# Altium schematic sheet PLACALDR.SchDoc
size A4
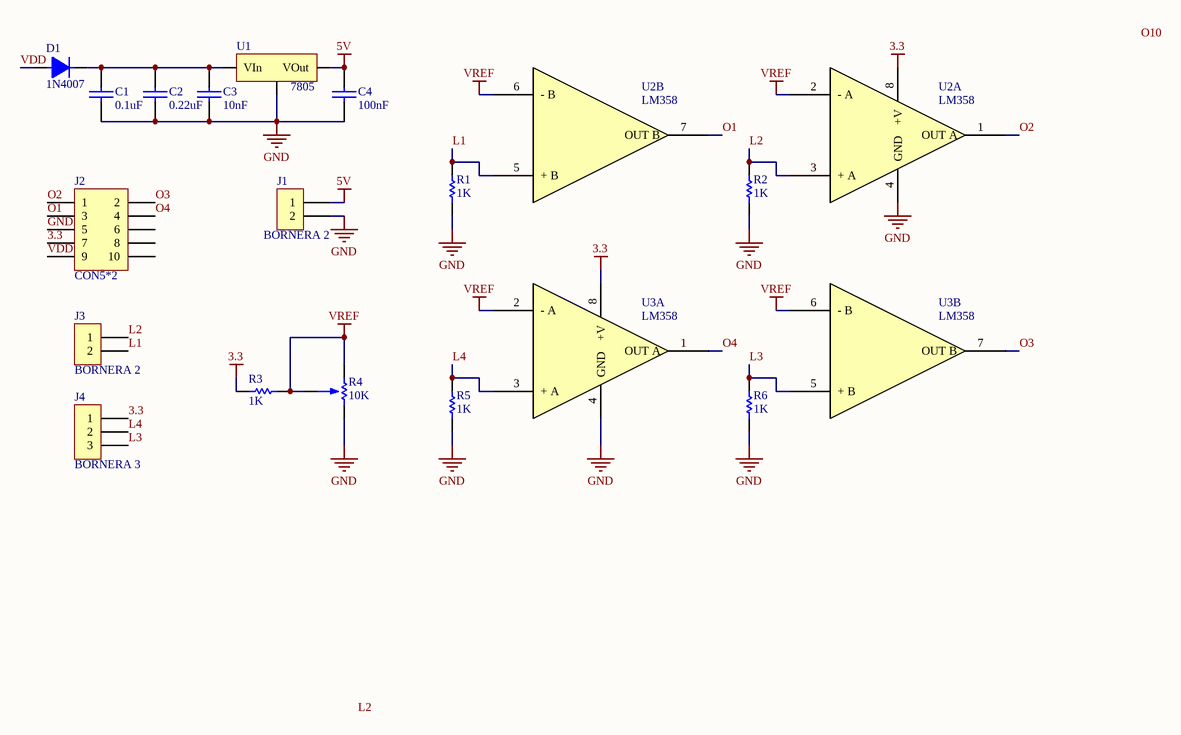
[diagram p0: PLACALDR.SchDoc]

## Parts
C1  0.1uF  [CAP100]
C2  0.22uF  [CAP100]
C3  10nF  [CAP100]
C4  100nF  [CAP100]
D1  1N4007  [DO41]
J1  BORNERA 2  [BORNERA2]
J2  CON5*2  [SIP5*2]
J3  BORNERA 2  [BORNERA2]
J4  BORNERA 3  [BORNERA3]
R1  1K  [RES400]
R2  1K  [RES400]
R3  1K  [RES400]
R4  10K  [PRESET H]
R5  1K  [RES400]
R6  1K  [RES400]
U1  7805  [TO-220 V]
U2  LM358  [DIP8]  (parts A,B of 2)
U3  LM358  [DIP8]  (parts A,B of 2)

## Nets
3.3: J2.7 J4.1 R3.2 U2.8(+V) U3.8(+V)
5V: C4.1 J1.1 U1.3(VOut)
GND: C1.2 C2.2 C3.2 C4.2 J1.2 J2.5 R1.2 R2.2 R4.1 R5.2 R6.2 U1.2(GND) U2.4(GND) U3.4(GND)
VREF: R3.1 R4.2 R4.3 U2.2(-_A) U2.6(-_B) U3.2(-_A) U3.6(-_B)
L1: J3.2 R1.1 U2.5(+_B)
L2: J3.1 R2.1 U2.3(+_A)
L3: J4.3 R6.1 U3.5(+_B)
L4: J4.2 R5.1 U3.3(+_A)
O1: J2.3 U2.7(OUT_B)
O2: J2.1 U2.1(OUT_A)
O3: J2.2 U3.7(OUT_B)
O4: J2.4 U3.1(OUT_A)
VDD: D1.1 J2.9
NetC1_1: C1.1 C2.1 C3.1 D1.2 U1.1(VIn)

Not connected (* = marked no-connect by the designer): J2 6 8 10

## Notes on the sheet
- Labels drawn without touching a wire or pin: L2, O10
- Title
- Size:
- Date:
- A4
- Number:
- Time:
- Revision:
- Sheet
- of
- File:

## Library data of the parts
C1-C4 = CAP
D1 = DIODO
R1-R3 R5 R6 = RES
R4 = PRESET
U1 = 78XX: REGULDOR POSITIVO